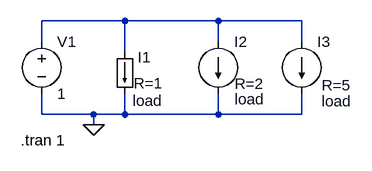
[diagram p0: schematic Fig_2-59_I_load=R_3types.asc]
Fig_2-59_I_load=R_3types.asc, the LTspice schematic file:
Version 4
SHEET 1 880 680
WIRE 240 96 112 96
WIRE 384 96 240 96
WIRE 512 96 384 96
WIRE 112 128 112 96
WIRE 384 128 384 96
WIRE 512 128 512 96
WIRE 240 144 240 96
WIRE 112 240 112 208
WIRE 192 240 112 240
WIRE 240 240 240 208
WIRE 240 240 192 240
WIRE 384 240 384 208
WIRE 384 240 240 240
WIRE 512 240 512 208
WIRE 512 240 384 240
WIRE 192 256 192 240
FLAG 192 256 0
SYMBOL voltage 112 112 R0
WINDOW 123 0 0 Left 2
WINDOW 39 0 0 Left 2
SYMATTR InstName V1
SYMATTR Value 1
SYMBOL load 224 144 R0
WINDOW 3 30 48 Left 2
WINDOW 39 28 75 Left 2
SYMATTR Value R=1
SYMATTR SpiceLine load
SYMATTR InstName I1
SYMBOL load2 384 128 R0
WINDOW 3 25 65 Left 2
WINDOW 39 25 89 Left 2
SYMATTR Value R=2
SYMATTR SpiceLine load
SYMATTR InstName I2
SYMBOL current 512 128 R0
WINDOW 3 31 67 Left 2
WINDOW 39 31 92 Left 2
SYMATTR Value R=5
SYMATTR SpiceLine load
SYMATTR InstName I3
TEXT 80 280 Left 2 !.tran 1

The netlist it stands for:
* Fig_2-59_I_load=R_3types.asc
V1 N001 0 1
I1 N001 0 R=1 load
I2 N001 0 R=2 load
I3 N001 0 R=5 load
.tran 1
.backanno
.end